# EAGLE design drv8353 based bldc (EAGLE 9.5.0)

## Sheet 1 of 3: Gate Driver & Signal Headers
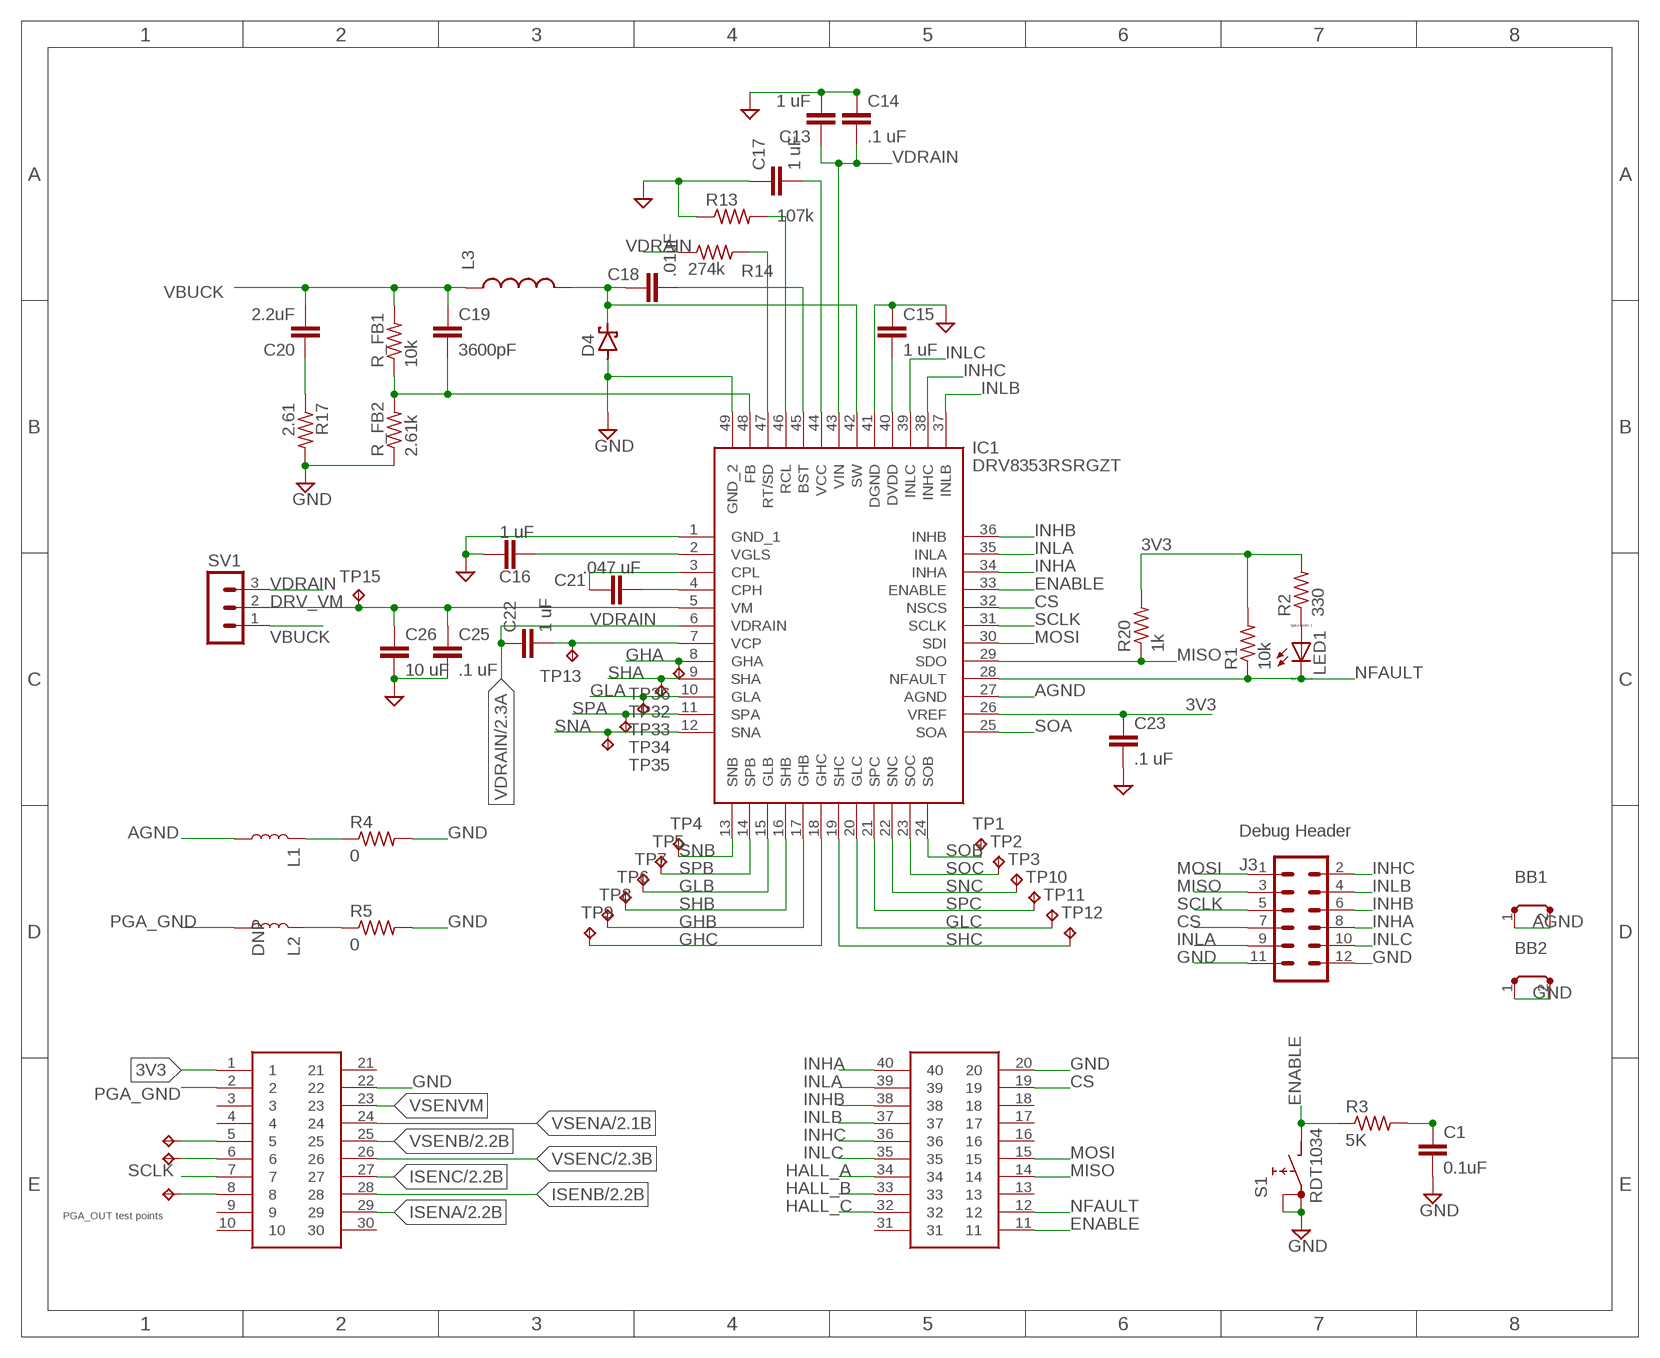
[diagram p0: schematic, sheet 1]

### Parts
BB1  TE3/2  [TE3/2]
BB2  TE3/2  [TE3/2]
C1  0.1uF  C-EUC0603K  [C0603K]
C13  1 uF  C-EUC1206K  [C1206K]
C14  .1 uF  C-EUC0805K  [C0805K]
C15  1 uF  C-EUC0603K  [C0603K]
C16  1 uF  C-EUC0603K  [C0603K]
C17  1 uF  C-EUC0603K  [C0603K]
C18  .01uF  C-EUC0603K  [C0603K]
C19  3600pF  C-EUC0603K  [C0603K]
C20  2.2uF  C-EUC0805K  [C0805K]
C21  .047 uF  C-EUC0805K  [C0805K]
C22  1 uF  C-EUC0603K  [C0603K]
C23  .1 uF  C-EUC0603K  [C0603K]
C25  .1 uF  C-EUC0805K  [C0805K]
C26  10 uF  C-EUC2220K  [C2220K]
D4  DFLS1200  [DFLS1200]
IC1  DRV8353RSRGZT  [QFN50P700X700X100-49N]
J3  2X6 FEMALE  CONN_06X2PTH_FEMALE  [2X6]
L1  33nH/±5%/500mA  INDUCTOR-0603-33NH  [0603]
L2  DNP  INDUCTOR-0603-33NH  [0603]
L3  330 uH  74404084331  [74404084331]
LED1  LED_ESML0603  [LED_SML0603]
R1  10k  R-US_R0603  [R0603]
R2  330  R-US_R0603  [R0603]
R3  5K  R-US_R0603  [R0603]
R4  0  R-US_R0603  [R0603]
R5  0  R-US_R0603  [R0603]
R13  107k  R-US_R0603  [R0603]
R14  274k  R-US_R0603  [R0603]
R17  2.61  R-US_R0603  [R0603]
R20  1k  R-US_R0603  [R0603]
R_FB1  10k  R-US_R0603  [R0603]
R_FB2  2.61k  R-US_R0603  [R0603]
S1  RDT1034  [RDT1034]
SV1  MA03-1  [MA03-1]
TP1  TPB1,27  [B1,27]
TP2  TPB1,27  [B1,27]
TP3  TPB1,27  [B1,27]
TP4  TPB1,27  [B1,27]
TP5  TPB1,27  [B1,27]
TP6  TPB1,27  [B1,27]
TP7  TPB1,27  [B1,27]
TP8  TPB1,27  [B1,27]
TP9  TPB1,27  [B1,27]
TP10  TPB1,27  [B1,27]
TP11  TPB1,27  [B1,27]
TP12  TPB1,27  [B1,27]
TP13  TPB1,27  [B1,27]
TP15  TPB1,27  [B1,27]
TP32  TPB1,27  [B1,27]
TP33  TPB1,27  [B1,27]
TP34  TPB1,27  [B1,27]
TP35  TPB1,27  [B1,27]
TP36  TPB1,27  [B1,27]
TP37  TPB1,27  [B1,27]
TP38  TPB1,27  [B1,27]
TP39  TPB1,27  [B1,27]
U$2  BOOSTER_DOCK  [BOOSTER_DOCK]

### Nets
3V3: C23.1 IC1.26(VREF) R1.2 R2.2 R20.2 U$2.1 ; also sheet 3
AGND: BB1.1(P) BB1.2(P) IC1.27(AGND) L1.1
BST: C18.2 IC1.45(BST)
CPH: C21.2 IC1.4(CPH)
CPL: C21.1 IC1.3(CPL)
CS: IC1.32(NSCS) J3.7 U$2.19
DRV_VM: C25.1 C26.1 IC1.5(VM) SV1.2 TP15.TP
ENABLE: IC1.33(ENABLE) R3.1 S1.B U$2.11
FB: C19.2 IC1.48(FB) R_FB1.1 R_FB2.2
GHA: IC1.8(GHA) TP36.TP ; also sheet 2
GHB: IC1.17(GHB) TP8.TP ; also sheet 2
GHC: IC1.18(GHC) TP9.TP ; also sheet 2
GLA: IC1.10(GLA) TP33.TP ; also sheet 2
GLB: IC1.15(GLB) TP7.TP ; also sheet 2
GLC: IC1.20(GLC) TP11.TP ; also sheet 2
GND: BB2.1(P) BB2.2(P) C1.2 C13.2 C14.1 C15.1 C16.1 C17.1 C23.2 C25.2 C26.2 D4.GND IC1.1(GND_1) IC1.41(DGND) IC1.49(GND_2) J3.11 J3.12 R4.2 R5.2 R13.1 R17.2 R_FB2.1 S1.A S1.A1 U$2.20 U$2.22 ; also sheet 2,3
HALL_A: U$2.34 ; also sheet 3
HALL_B: U$2.33 ; also sheet 3
HALL_C: U$2.32 ; also sheet 3
INHA: IC1.34(INHA) J3.8 U$2.40
INHB: IC1.36(INHB) J3.6 U$2.38
INHC: IC1.38(INHC) J3.2 U$2.36
INLA: IC1.35(INLA) J3.9 U$2.39
INLB: IC1.37(INLB) J3.4 U$2.37
INLC: IC1.39(INLC) J3.10 U$2.35
ISENA: U$2.29 ; also sheet 2
ISENB: U$2.28 ; also sheet 2
ISENC: U$2.27 ; also sheet 2
MISO: IC1.29(SDO) J3.3 R20.1 U$2.14
MOSI: IC1.30(SDI) J3.1 U$2.15
N$1: C15.2 IC1.40(DVDD)
N$14: C20.1 R17.1
N$16: LED1.A R2.1
N$17: TP39.TP U$2.8
N$18: TP38.TP U$2.6
N$19: TP37.TP U$2.5
N$20: C1.1 R3.2
N$21: L1.2 R4.1
N$23: L2.2 R5.1
NFAULT: IC1.28(NFAULT) LED1.C R1.1 U$2.12
PGA_GND: L2.1 U$2.2
RCL: IC1.46(RCL) R13.2
RT/SD: IC1.47(RT/SD) R14.2
SCLK: IC1.31(SCLK) J3.5 U$2.7
SHA: IC1.9(SHA) TP32.TP ; also sheet 2
SHB: IC1.16(SHB) TP6.TP ; also sheet 2
SHC: IC1.19(SHC) TP12.TP ; also sheet 2
SNA: IC1.12(SNA) TP35.TP ; also sheet 2
SNB: IC1.13(SNB) TP4.TP ; also sheet 2
SNC: IC1.22(SNC) TP3.TP ; also sheet 2
SOA: IC1.25(SOA) ; also sheet 2
SOB: IC1.24(SOB) TP1.TP ; also sheet 2
SOC: IC1.23(SOC) TP2.TP ; also sheet 2
SPA: IC1.11(SPA) TP34.TP ; also sheet 2
SPB: IC1.14(SPB) TP5.TP ; also sheet 2
SPC: IC1.21(SPC) TP10.TP ; also sheet 2
SW: C18.1 D4.LINE IC1.42(SW) L3.P$2
VBUCK: C19.1 C20.2 L3.P$1 R_FB1.2 SV1.1 ; also sheet 3
VCC: C17.2 IC1.44(VCC)
VCP: C22.2 IC1.7(VCP) TP13.TP
VDRAIN: C13.1 C14.2 C22.1 IC1.6(VDRAIN) IC1.43(VIN) R14.1 SV1.3 ; also sheet 2,3
VGLS: C16.2 IC1.2(VGLS)
VSENA: U$2.24 ; also sheet 2,3
VSENB: U$2.25 ; also sheet 2,3
VSENC: U$2.26 ; also sheet 2,3
VSENVM: U$2.23 ; also sheet 3
Unconnected: U$2.3 U$2.4 U$2.9 U$2.10 U$2.13 U$2.16 U$2.17 U$2.18 U$2.21 U$2.30 U$2.31

### Notes on the sheet
- Debug Header
- PGA_OUT test points

## Sheet 2 of 3: Half Bridges
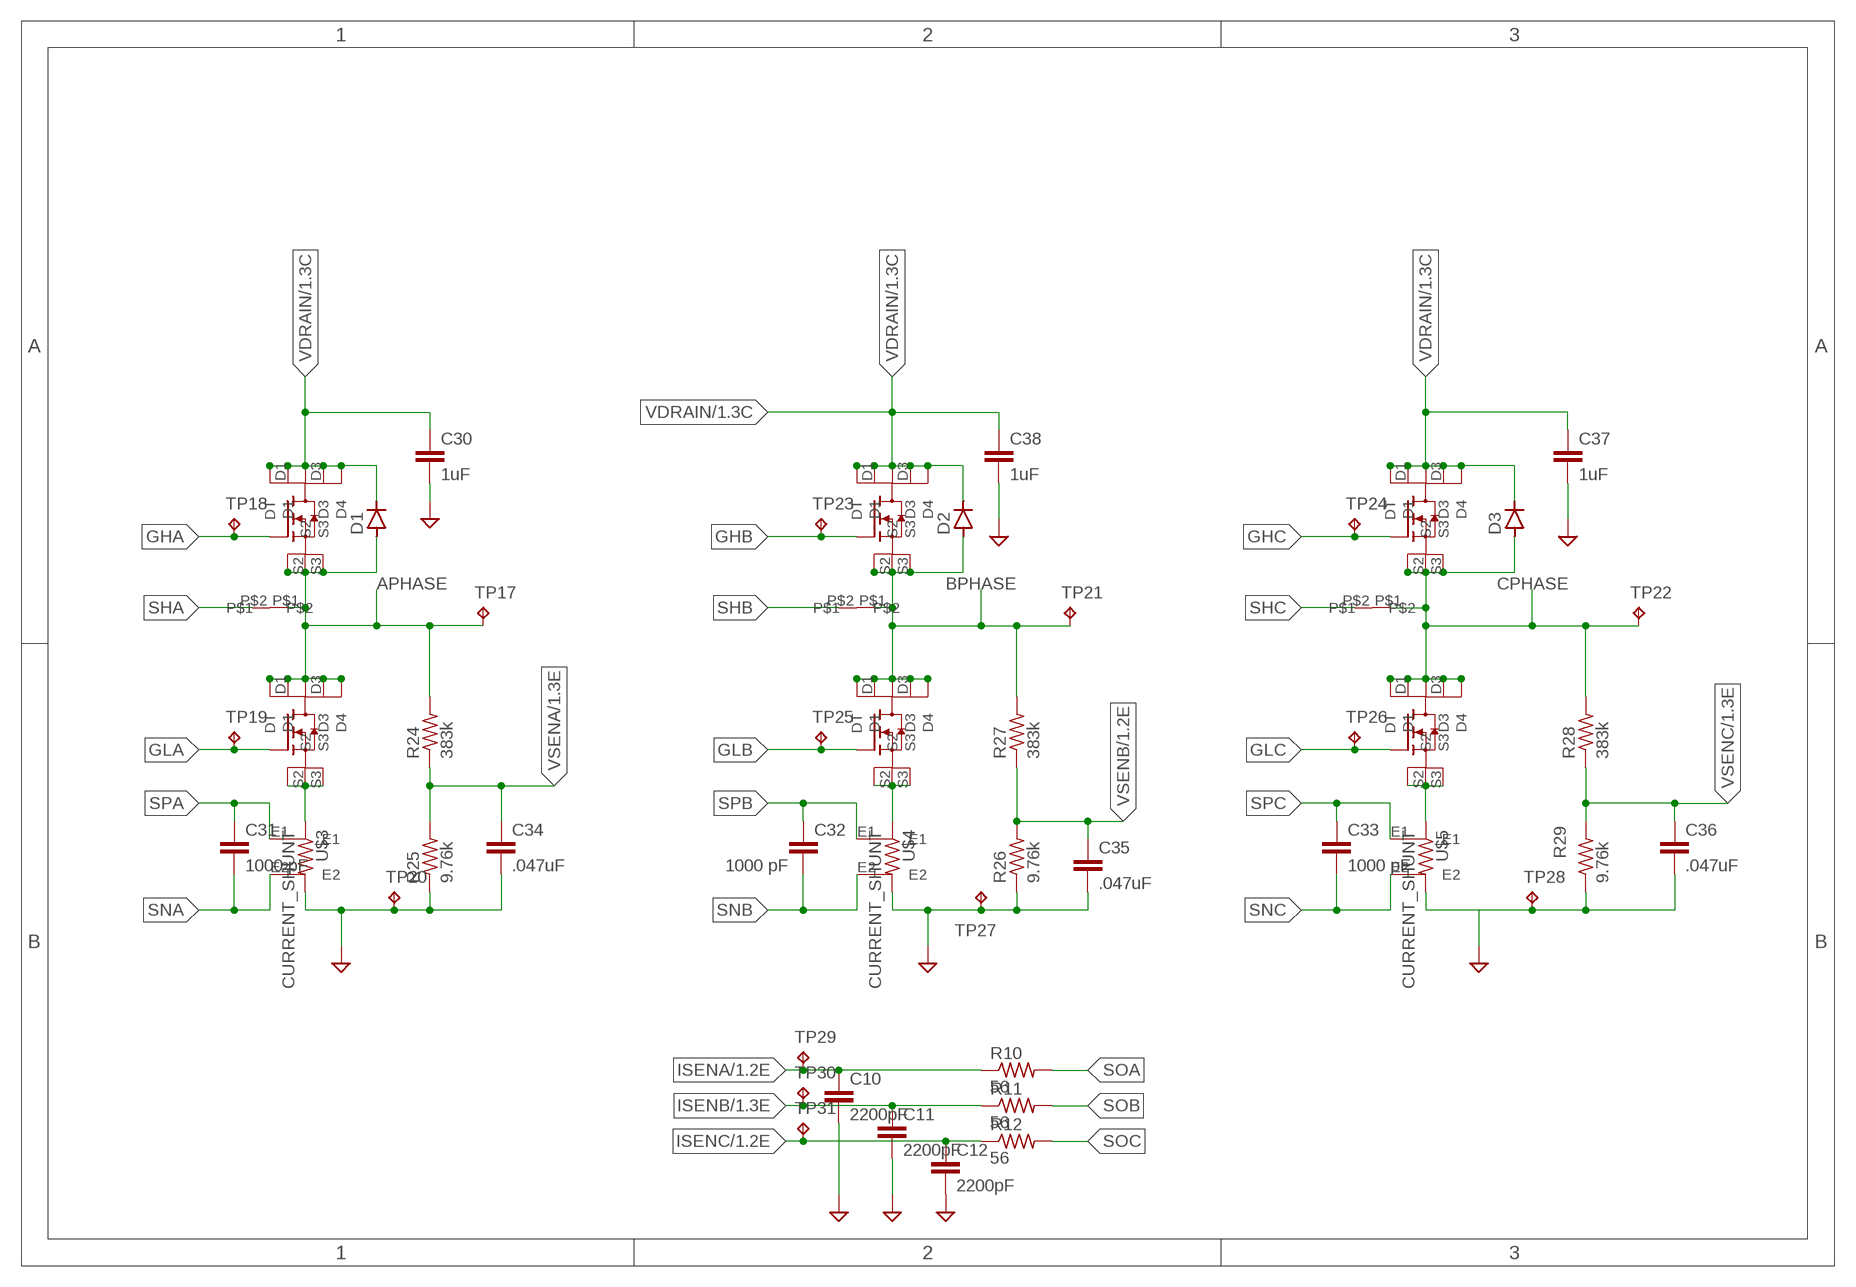
[diagram p1: schematic, sheet 2]

### Parts
C10  2200pF  C-EUC0603K  [C0603K]
C11  2200pF  C-EUC0603K  [C0603K]
C12  2200pF  C-EUC0603K  [C0603K]
C30  1uF  C-EUC1206  [C1206]
C31  1000 pF  C-EUC0603K  [C0603K]
C32  1000 pF  C-EUC0603K  [C0603K]
C33  1000 pF  C-EUC0603K  [C0603K]
C34  .047uF  C-EUC0603K  [C0603K]
C35  .047uF  C-EUC0603K  [C0603K]
C36  .047uF  C-EUC0603K  [C0603K]
C37  1uF  C-EUC0603K  [C0603K]
C38  1uF  C-EUC0603K  [C0603K]
D1  D-SOD123  [SOD123]
D2  D-SOD123  [SOD123]
D3  D-SOD123  [SOD123]
R10  56  R-US_R0603  [R0603]
R11  56  R-US_R0603  [R0603]
R12  56  R-US_R0603  [R0603]
R24  383k  R-US_R0603  [R0603]
R25  9.76k  R-US_R0603  [R0603]
R26  9.76k  R-US_R0603  [R0603]
R27  383k  R-US_R0603  [R0603]
R28  383k  R-US_R0603  [R0603]
R29  9.76k  R-US_R0603  [R0603]
TP17  TPB1,27  [B1,27]
TP18  TPB1,27  [B1,27]
TP19  TPB1,27  [B1,27]
TP20  TPB1,27  [B1,27]
TP21  TPB1,27  [B1,27]
TP22  TPB1,27  [B1,27]
TP23  TPB1,27  [B1,27]
TP24  TPB1,27  [B1,27]
TP25  TPB1,27  [B1,27]
TP26  TPB1,27  [B1,27]
TP27  TPB1,27  [B1,27]
TP28  TPB1,27  [B1,27]
TP29  TPB1,27  [B1,27]
TP30  TPB1,27  [B1,27]
TP31  TPB1,27  [B1,27]
U$3  CURRENT_SHUNT  [VISH_CSM3637_.002-2]
U$4  CURRENT_SHUNT  [VISH_CSM3637_.002-2]
U$5  CURRENT_SHUNT  [VISH_CSM3637_.002-2]
U$14  NVMTS1D2N08H  [PQFN88]
U$20  NVMTS1D2N08H  [PQFN88]
U$21  NVMTS1D2N08H  [PQFN88]
U$22  NVMTS1D2N08H  [PQFN88]
U$23  NVMTS1D2N08H  [PQFN88]
U$24  NVMTS1D2N08H  [PQFN88]
U$25  NET_TIE  [CNT]
U$27  NET_TIE  [CNT]
U$30  NET_TIE  [CNT]

### Nets
APHASE: D1.2(A) R24.2 TP17.TP U$14.S1 U$14.S2 U$14.S3 U$20.D1 U$20.D2 U$20.D3 U$20.D4 U$20.DT U$25.P$1 ; also sheet 3
BPHASE: D2.2(A) R27.2 TP21.TP U$21.D1 U$21.D2 U$21.D3 U$21.D4 U$21.DT U$22.S1 U$22.S2 U$22.S3 U$27.P$1 ; also sheet 3
CPHASE: D3.2(A) R28.2 TP22.TP U$23.S1 U$23.S2 U$23.S3 U$24.D1 U$24.D2 U$24.D3 U$24.D4 U$24.DT U$30.P$1 ; also sheet 3
GHA: TP18.TP U$14.G ; also sheet 1
GHB: TP23.TP U$22.G ; also sheet 1
GHC: TP24.TP U$23.G ; also sheet 1
GLA: TP19.TP U$20.G ; also sheet 1
GLB: TP25.TP U$21.G ; also sheet 1
GLC: TP26.TP U$24.G ; also sheet 1
GND: C10.2 C11.2 C12.2 C30.2 C34.2 C35.2 C36.2 C37.2 C38.2 R25.1 R26.1 R29.1 TP20.TP TP27.TP TP28.TP U$3.I2 U$4.I2 U$5.I2 ; also sheet 1,3
ISENA: C10.1 R10.1 TP29.TP ; also sheet 1
ISENB: C11.1 R11.1 TP30.TP ; also sheet 1
ISENC: C12.1 R12.1 TP31.TP ; also sheet 1
N$22: U$4.I1 U$21.S1 U$21.S2 U$21.S3
N$24: U$3.I1 U$20.S1 U$20.S2 U$20.S3
N$27: U$5.I1 U$24.S1 U$24.S2 U$24.S3
SHA: U$25.P$2 ; also sheet 1
SHB: U$27.P$2 ; also sheet 1
SHC: U$30.P$2 ; also sheet 1
SNA: C31.2 U$3.E2 ; also sheet 1
SNB: C32.2 U$4.E2 ; also sheet 1
SNC: C33.2 U$5.E2 ; also sheet 1
SOA: R10.2 ; also sheet 1
SOB: R11.2 ; also sheet 1
SOC: R12.2 ; also sheet 1
SPA: C31.1 U$3.E1 ; also sheet 1
SPB: C32.1 U$4.E1 ; also sheet 1
SPC: C33.1 U$5.E1 ; also sheet 1
VDRAIN: C30.1 C37.1 C38.1 D1.1(C) D2.1(C) D3.1(C) U$14.D1 U$14.D2 U$14.D3 U$14.D4 U$14.DT U$22.D1 U$22.D2 U$22.D3 U$22.D4 U$22.DT U$23.D1 U$23.D2 U$23.D3 U$23.D4 U$23.DT ; also sheet 1,3
VSENA: C34.1 R24.1 R25.2 ; also sheet 1,3
VSENB: C35.1 R26.2 R27.1 ; also sheet 1,3
VSENC: C36.1 R28.1 R29.2 ; also sheet 1,3

## Sheet 3 of 3: Power Connections / Converters
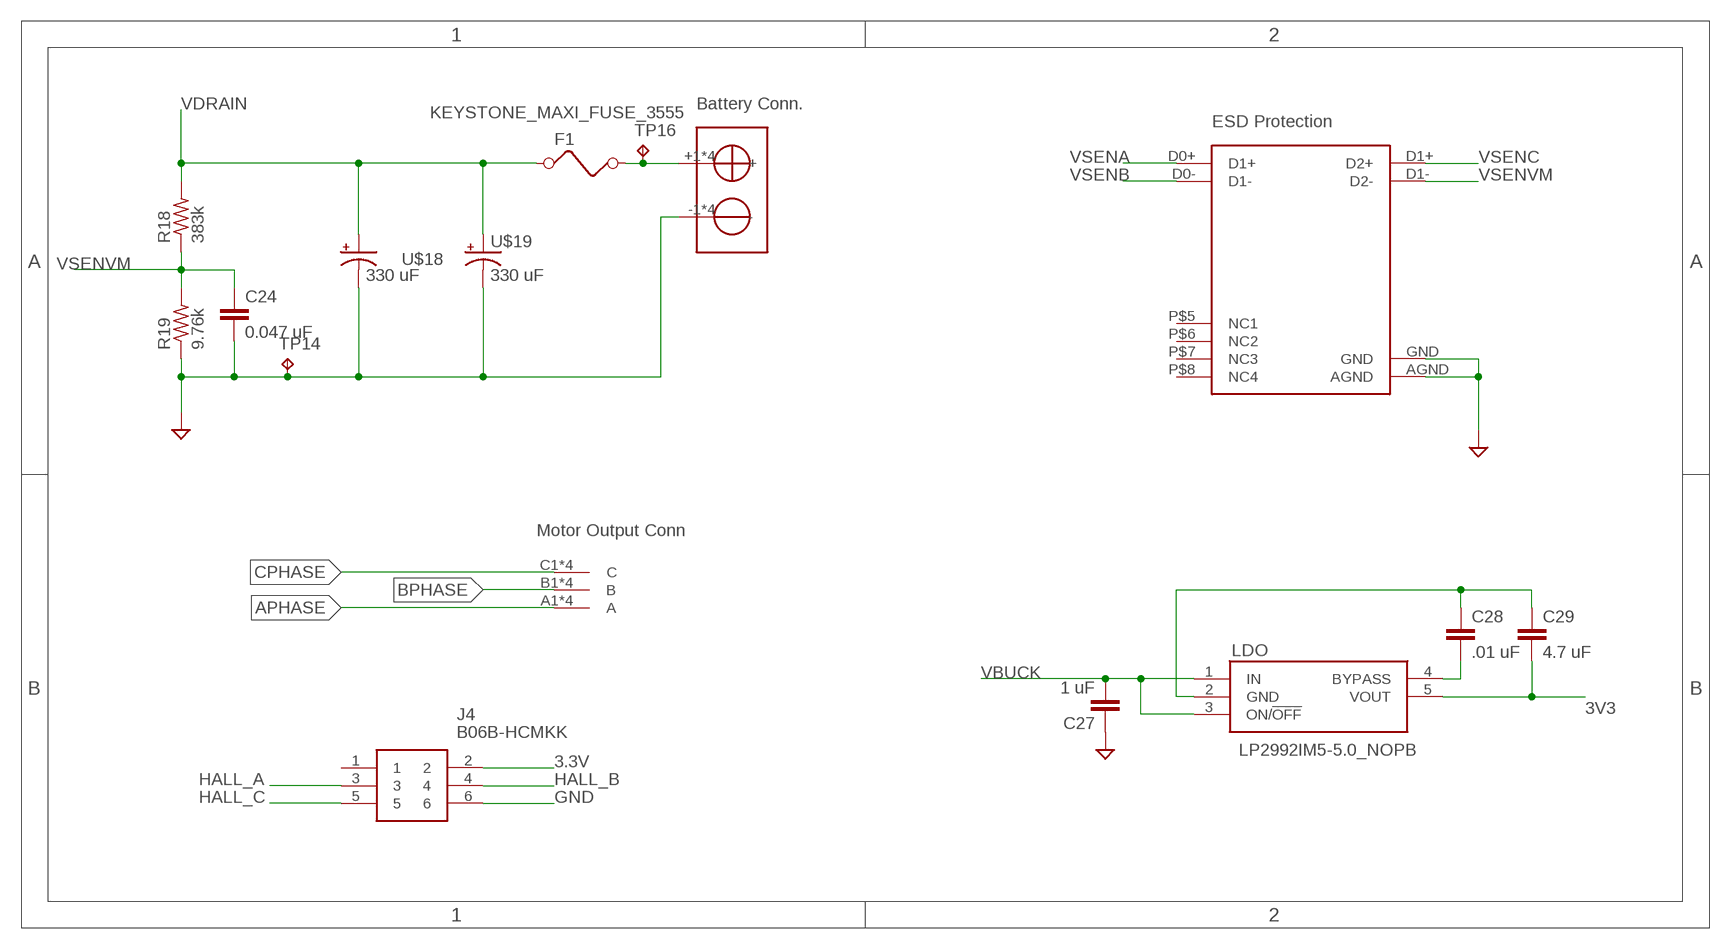
[diagram p2: schematic, sheet 3]

### Parts
C24  0.047 uF  C-EUC0603K  [C0603K]
C27  1 uF  C-EUC0805K  [C0805K]
C28  .01 uF  C-EUC0603K  [C0603K]
C29  4.7 uF  C-EUC1210K  [C1210K]
F1  KEYSTONE_MAXI_FUSE_3555  [KEYSTONE_MAXI_FUSE_CLIP_3555]
J4  B06B-HCMKK  [B06BHCMKK]
LDO  LP2992IM5-5.0_NOPB  [SOT95P280X145-5N]
R18  383k  R-US_R0603  [R0603]
R19  9.76k  R-US_R0603  [R0603]
TP14  TPB1,27  [B1,27]
TP16  TPB1,27  [B1,27]
TVS_DIODE  TPD4S010DQAR  [TPD4S010DQAR]
U$1  TRIPPLE-MINI-PP75  [TRIPPLE-MINI-PP75]
U$16  SB50  [MINI-SB-50]
U$18  330 uF  RADIALK16  [SM_RADIAL_K16_1PRIMARY]
U$19  330 uF  RADIALK16  [SM_RADIAL_K16_1PRIMARY]

### Nets
3.3V: J4.2
3V3: C29.2 LDO.5(VOUT) ; also sheet 1
APHASE: U$1.A1(A) U$1.A2(A) U$1.A3(A) U$1.A4(A) ; also sheet 2
BPHASE: U$1.B1(B) U$1.B2(B) U$1.B3(B) U$1.B4(B) ; also sheet 2
CPHASE: U$1.C1(C) U$1.C2(C) U$1.C3(C) U$1.C4(C) ; also sheet 2
GND: C24.2 C27.1 J4.6 R19.1 TP14.TP TVS_DIODE.AGND TVS_DIODE.GND U$16.-1(-) U$16.-2(-) U$16.-3(-) U$16.-4(-) U$18.- U$19.- ; also sheet 1,2
HALL_A: J4.3 ; also sheet 1
HALL_B: J4.4 ; also sheet 1
HALL_C: J4.5 ; also sheet 1
N$5: C28.1 C29.1 LDO.2(GND)
N$13: C28.2 LDO.4(BYPASS)
N$15: F1.B1 F1.B2 TP16.TP U$16.+1(+) U$16.+2(+) U$16.+3(+) U$16.+4(+)
VBUCK: C27.2 LDO.1(IN) LDO.3(ON/!OFF) ; also sheet 1
VDRAIN: F1.A1 F1.A2 R18.2 U$18.+ U$19.+ ; also sheet 1,2
VSENA: TVS_DIODE.D0+(D1+) ; also sheet 1,2
VSENB: TVS_DIODE.D0-(D1-) ; also sheet 1,2
VSENC: TVS_DIODE.D1+(D2+) ; also sheet 1,2
VSENVM: C24.1 R18.1 R19.2 TVS_DIODE.D1-(D2-) ; also sheet 1
Unconnected: J4.1 TVS_DIODE.P$5(NC1) TVS_DIODE.P$6(NC2) TVS_DIODE.P$7(NC3) TVS_DIODE.P$8(NC4)

### Notes on the sheet
- Battery Conn.
- ESD Protection
- Motor Output Conn

## Library data of the parts
BB1 BB2 = busbar:TE3/2: BUS BAR 2 connections, grid 3 TE
C1 C14 C22 C23 = resistor:C-EU: CAPACITOR, European symbol
C10-C13 C15-C21 C24-C38 = rcl:C-EU: CAPACITOR, European symbol; SPICEPREFIX: C
D1-D3 = semicon-smd-ipc:D-: DIODE unfilled
D4 = REV BLDC:DFLS1200; SPICEPREFIX: B
F1 = REV BLDC:KEYSTONE_MAXI_FUSE_3555
IC1 = REV BLDC:DRV8353RSRGZT: 100-V Three-Phase Smart Gate Driver With Buck Regulator and Three Current Shunt Amplifiers Source: Datasheet <http://www.ti.com/lit/gpn/drv8353r>; DESCRIPTION: 100-V Three-Phase Smart Gate Driver With Buck Regulator and Three Current Shunt Amplifiers; HEIGHT: 1mm; MANUFACTURER_NAME: Texas Instruments; MANUFACTURER_PART_NUMBER: DRV8353RSRGZT; MOUSER_PART_NUMBER: 595-DRV8353RSRGZT; MOUSER_PRICE-STOCK: https://www.mouser.com/Search/Refine.aspx?Keyword=595-DRV8353RSRGZT
J3 = SparkFun-Connectors:CONN_06X2: Multi connection point. Often used as Generic Header-pin footprint for 0.1 inch spaced/style header connections On any of the 0.1 inch spaced packages, you can populate with these: Break Away Headers - Straight <https://www.sparkfun.com/products/116> (PRT-00116) Break Away Male Headers - Right Angle <https://www.sparkfun.com/products/553> (PRT-00553) Female Headers <https://www.sparkfun.com/products/115> (PRT-00115) Break Away Headers - Machine Pin <https://www.sparkfun.com/products/117> (PRT-00117) Break Away Female Headers - Swiss Machine Pin <https://www.sparkfun.com/products/743> (PRT-00743); PROD_ID: CONN-12423
J4 = SamacSys_Parts:B06B-HCMKK: Automotive Connectors 6P AIT Header Top Position (BLK) Source: Datasheet <https://componentsearchengine.com/Datasheets/1/B06B-HCMKK.pdf>; DESCRIPTION: Automotive Connectors 6P AIT Header Top Position (BLK); HEIGHT: 13.7mm; MANUFACTURER_NAME: JST (JAPAN SOLDERLESS TERMINALS); MANUFACTURER_PART_NUMBER: B06B-HCMKK; MOUSER_PART_NUMBER: 306-B06B-HCMKK; MOUSER_PRICE-STOCK: https://www.mouser.com/Search/Refine.aspx?Keyword=306-B06B-HCMKK
L1 = SparkFun-Coils:INDUCTOR: Inductors Resist changes in electrical current. Basically a coil of wire. SparkFun Products: SparkFun Load Cell Amplifier - HX711 <https://www.sparkfun.com/products/13879> IOIO-OTG - V2.2 <https://www.sparkfun.com/products/13613>; PROD_ID: NDUC-07874
L2 = SparkFun-Coils:INDUCTOR: Inductors Resist changes in electrical current. Basically a coil of wire. SparkFun Products: SparkFun Load Cell Amplifier - HX711 <https://www.sparkfun.com/products/13879> IOIO-OTG - V2.2 <https://www.sparkfun.com/products/13613>; PROD_ID: NDUC-07874; VALUE: 33nH/±5%/500mA
L3 = REV BLDC:74404084331
LDO = SamacSys_Parts:LP2992IM5-5.0_NOPB: Micropower 250 mA Low-Noise Ultra Low-Dropout Regulator Source: Datasheet <http://www.ti.com/lit/ds/symlink/lp2992.pdf>; DESCRIPTION: Micropower 250 mA Low-Noise Ultra Low-Dropout Regulator; HEIGHT: 1.45mm; MANUFACTURER_NAME: Texas Instruments; MANUFACTURER_PART_NUMBER: LP2992IM5-5.0/NOPB; MOUSER_PART_NUMBER: 926-2992IM5-5.0/NOPB; MOUSER_PRICE-STOCK: https://www.mouser.com/Search/Refine.aspx?Keyword=926-2992IM5-5.0%2FNOPB
LED1 = eagle-ltspice:LED_E: LED Source: http://www.osram.convergy.de Source: www.luxeon.com Source: www.kingbright.com; SPICEMODEL: NONE; SPICEPREFIX: D; SPICETYPE: diode
R1 R2 R10-R14 R17-R20 R24-R29 R_FB1 R_FB2 = rcl:R-US_: RESISTOR, American symbol; SPICEPREFIX: R
R3-R5 = resistor:R-US_: RESISTOR, American symbol
S1 = switch:RDT1034: PUSH SWITCH www.radiohm.com
SV1 = con-lstb:MA03-1: PIN HEADER; OC_FARNELL: unknown; OC_NEWARK: unknown
TP1-TP39 = testpad:TP: Test pad
TVS_DIODE = REV BLDC:TPD4S010DQAR
U$1 = REV BLDC:TRIPPLE-MINI-PP75
U$2 = REV BLDC:BOOSTER_DOCK
U$3-U$5 = REV BLDC:CURRENT_SHUNT
U$14 U$20-U$24 = REV BLDC:NVMTS1D2N08H
U$16 = REV BLDC:SB50
U$18 U$19 = REV BLDC:RADIALK16
U$25 U$27 U$30 = REV BLDC:NET_TIE

## Board
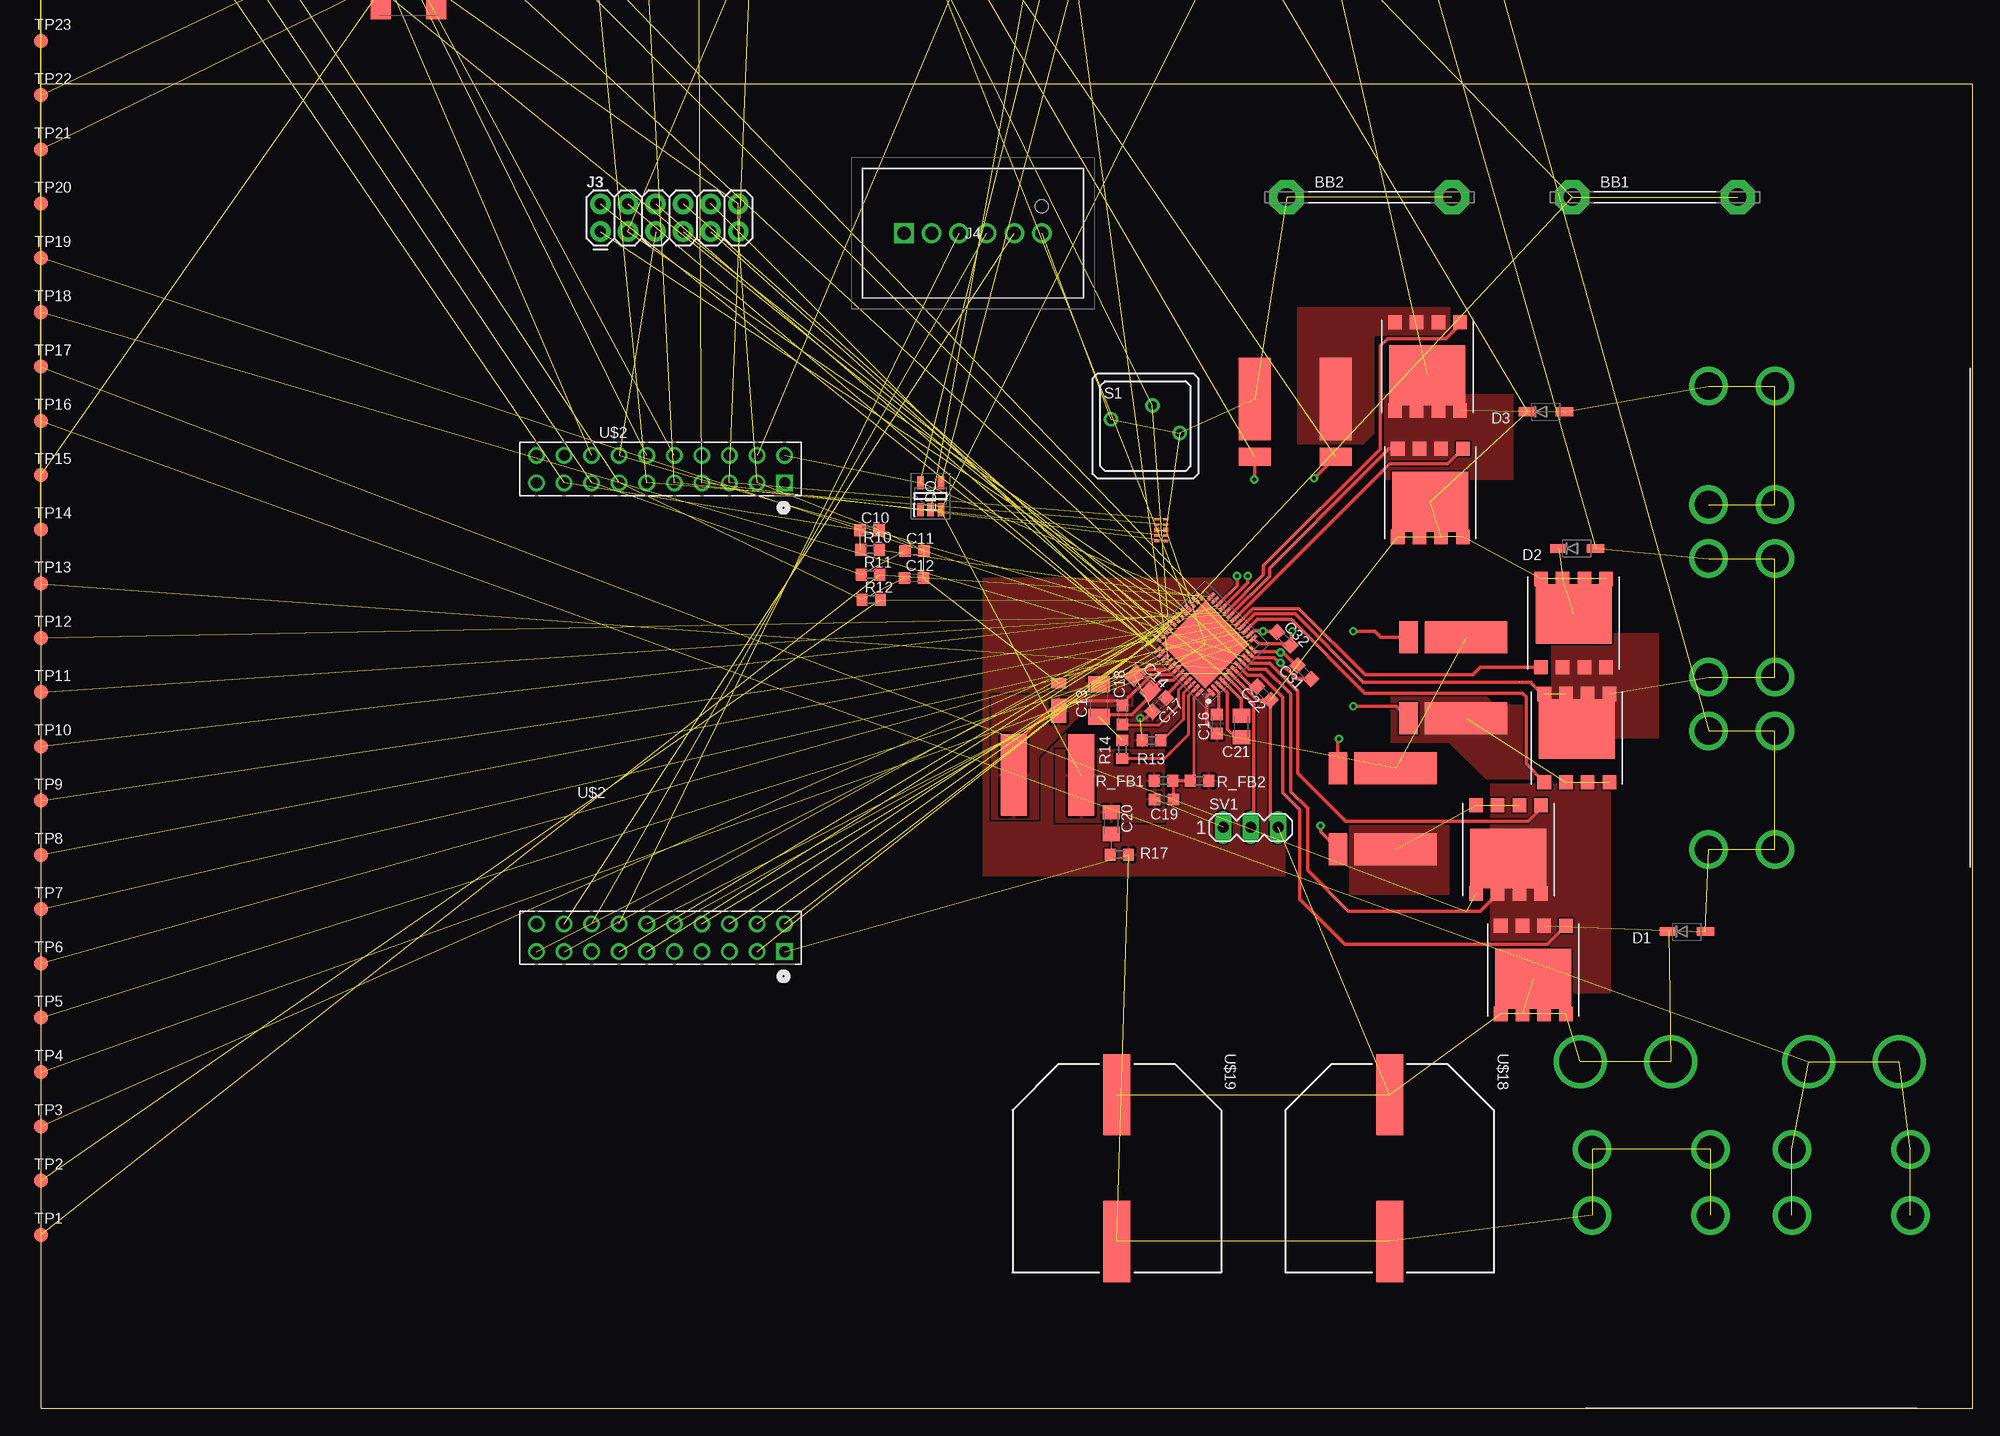
[diagram p3: board, top side]
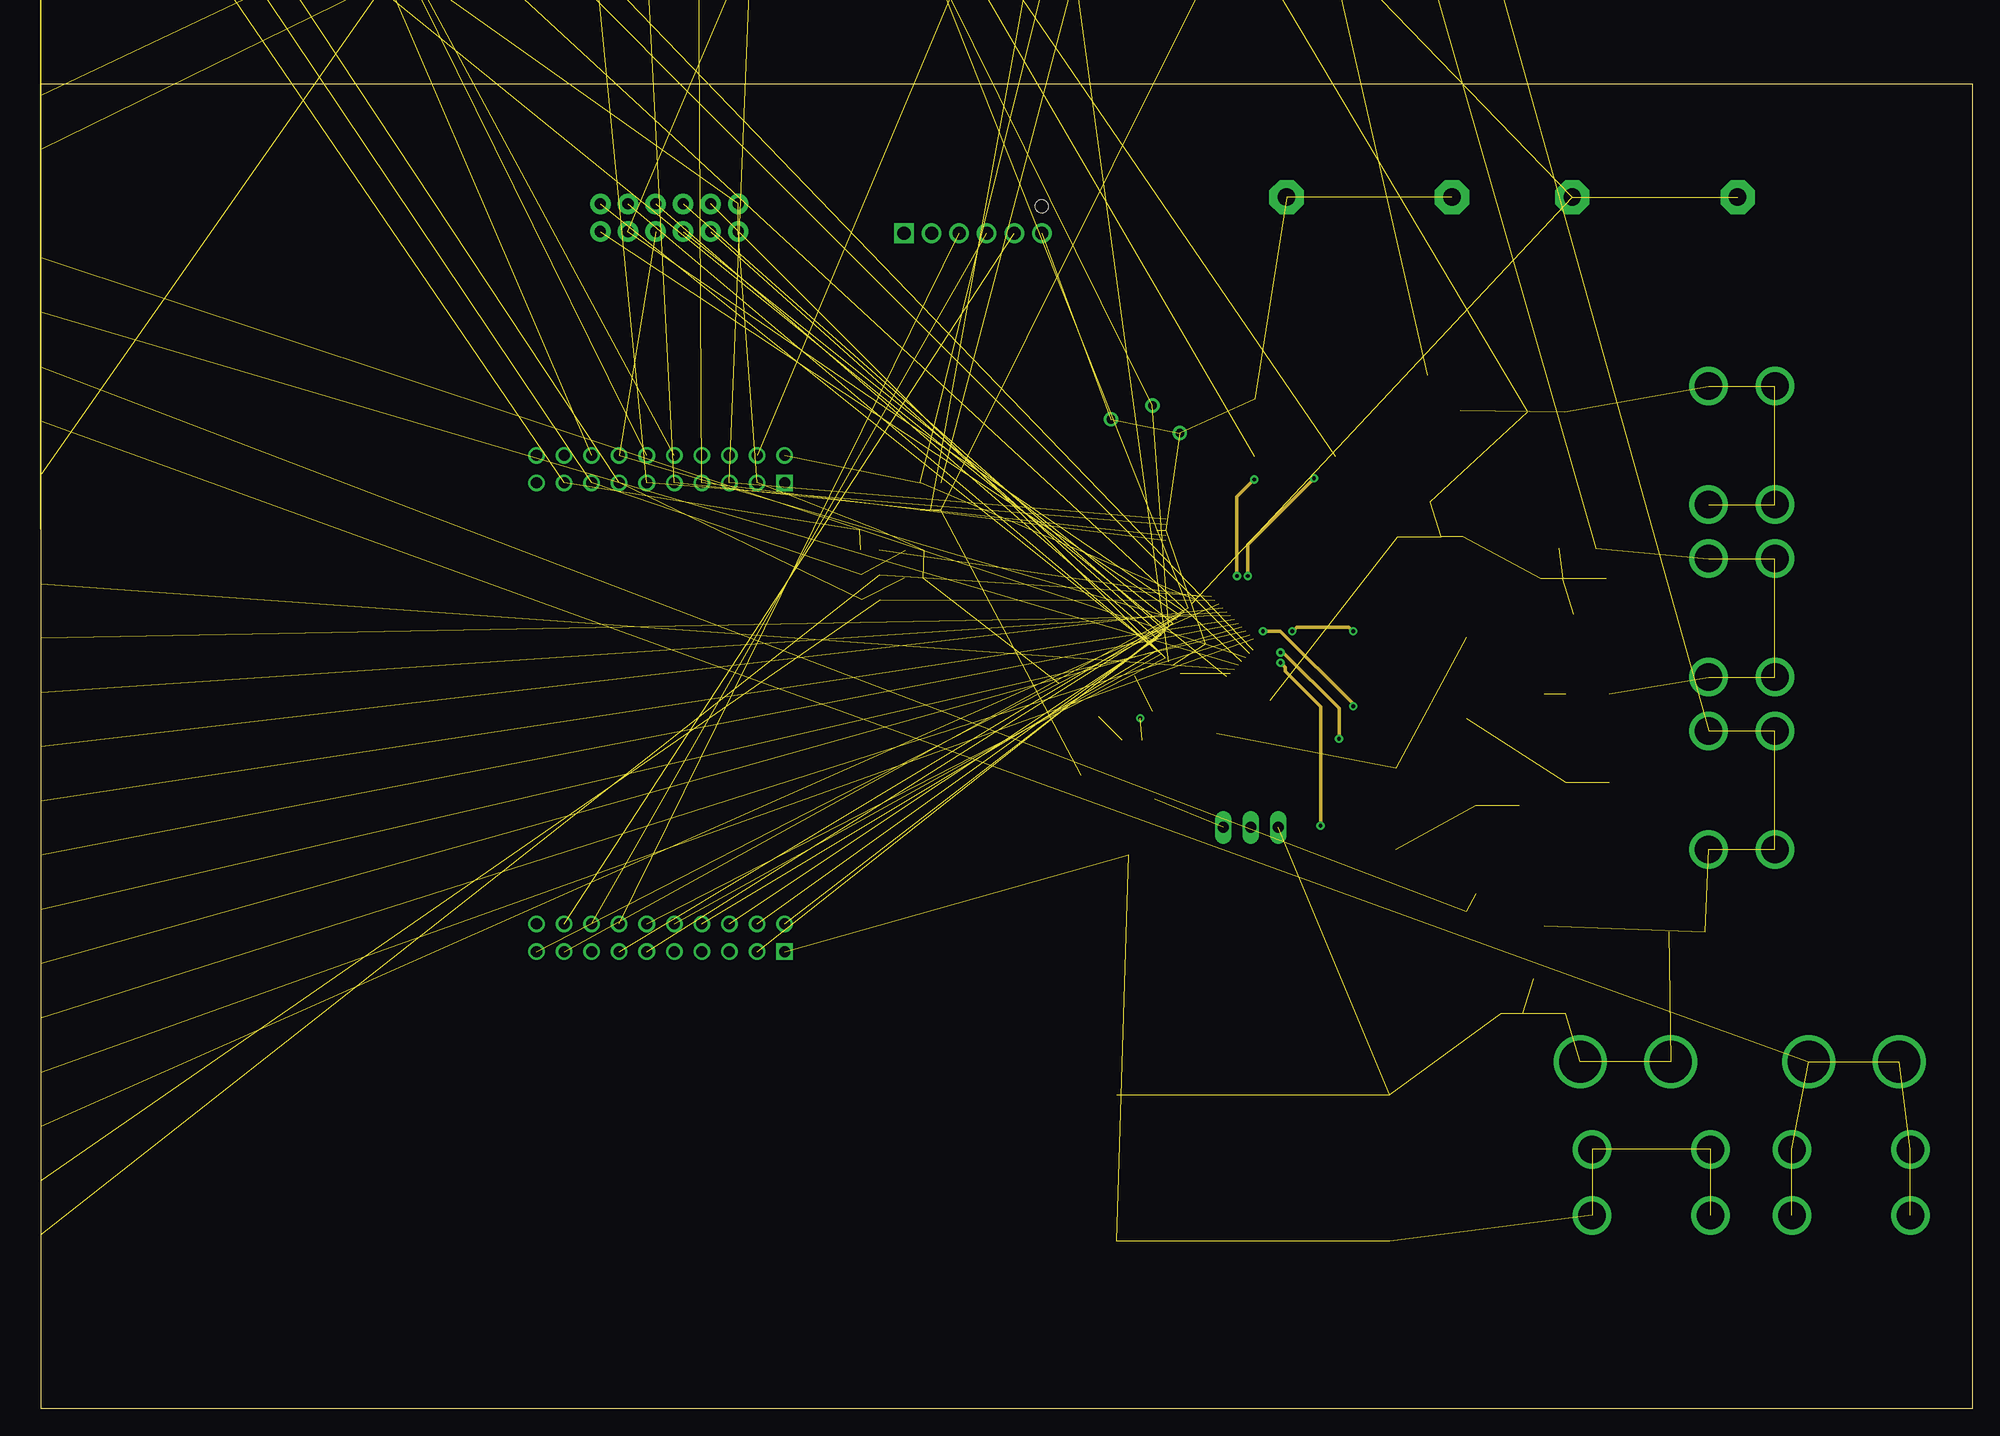
[diagram p4: board, inner layer Route15]
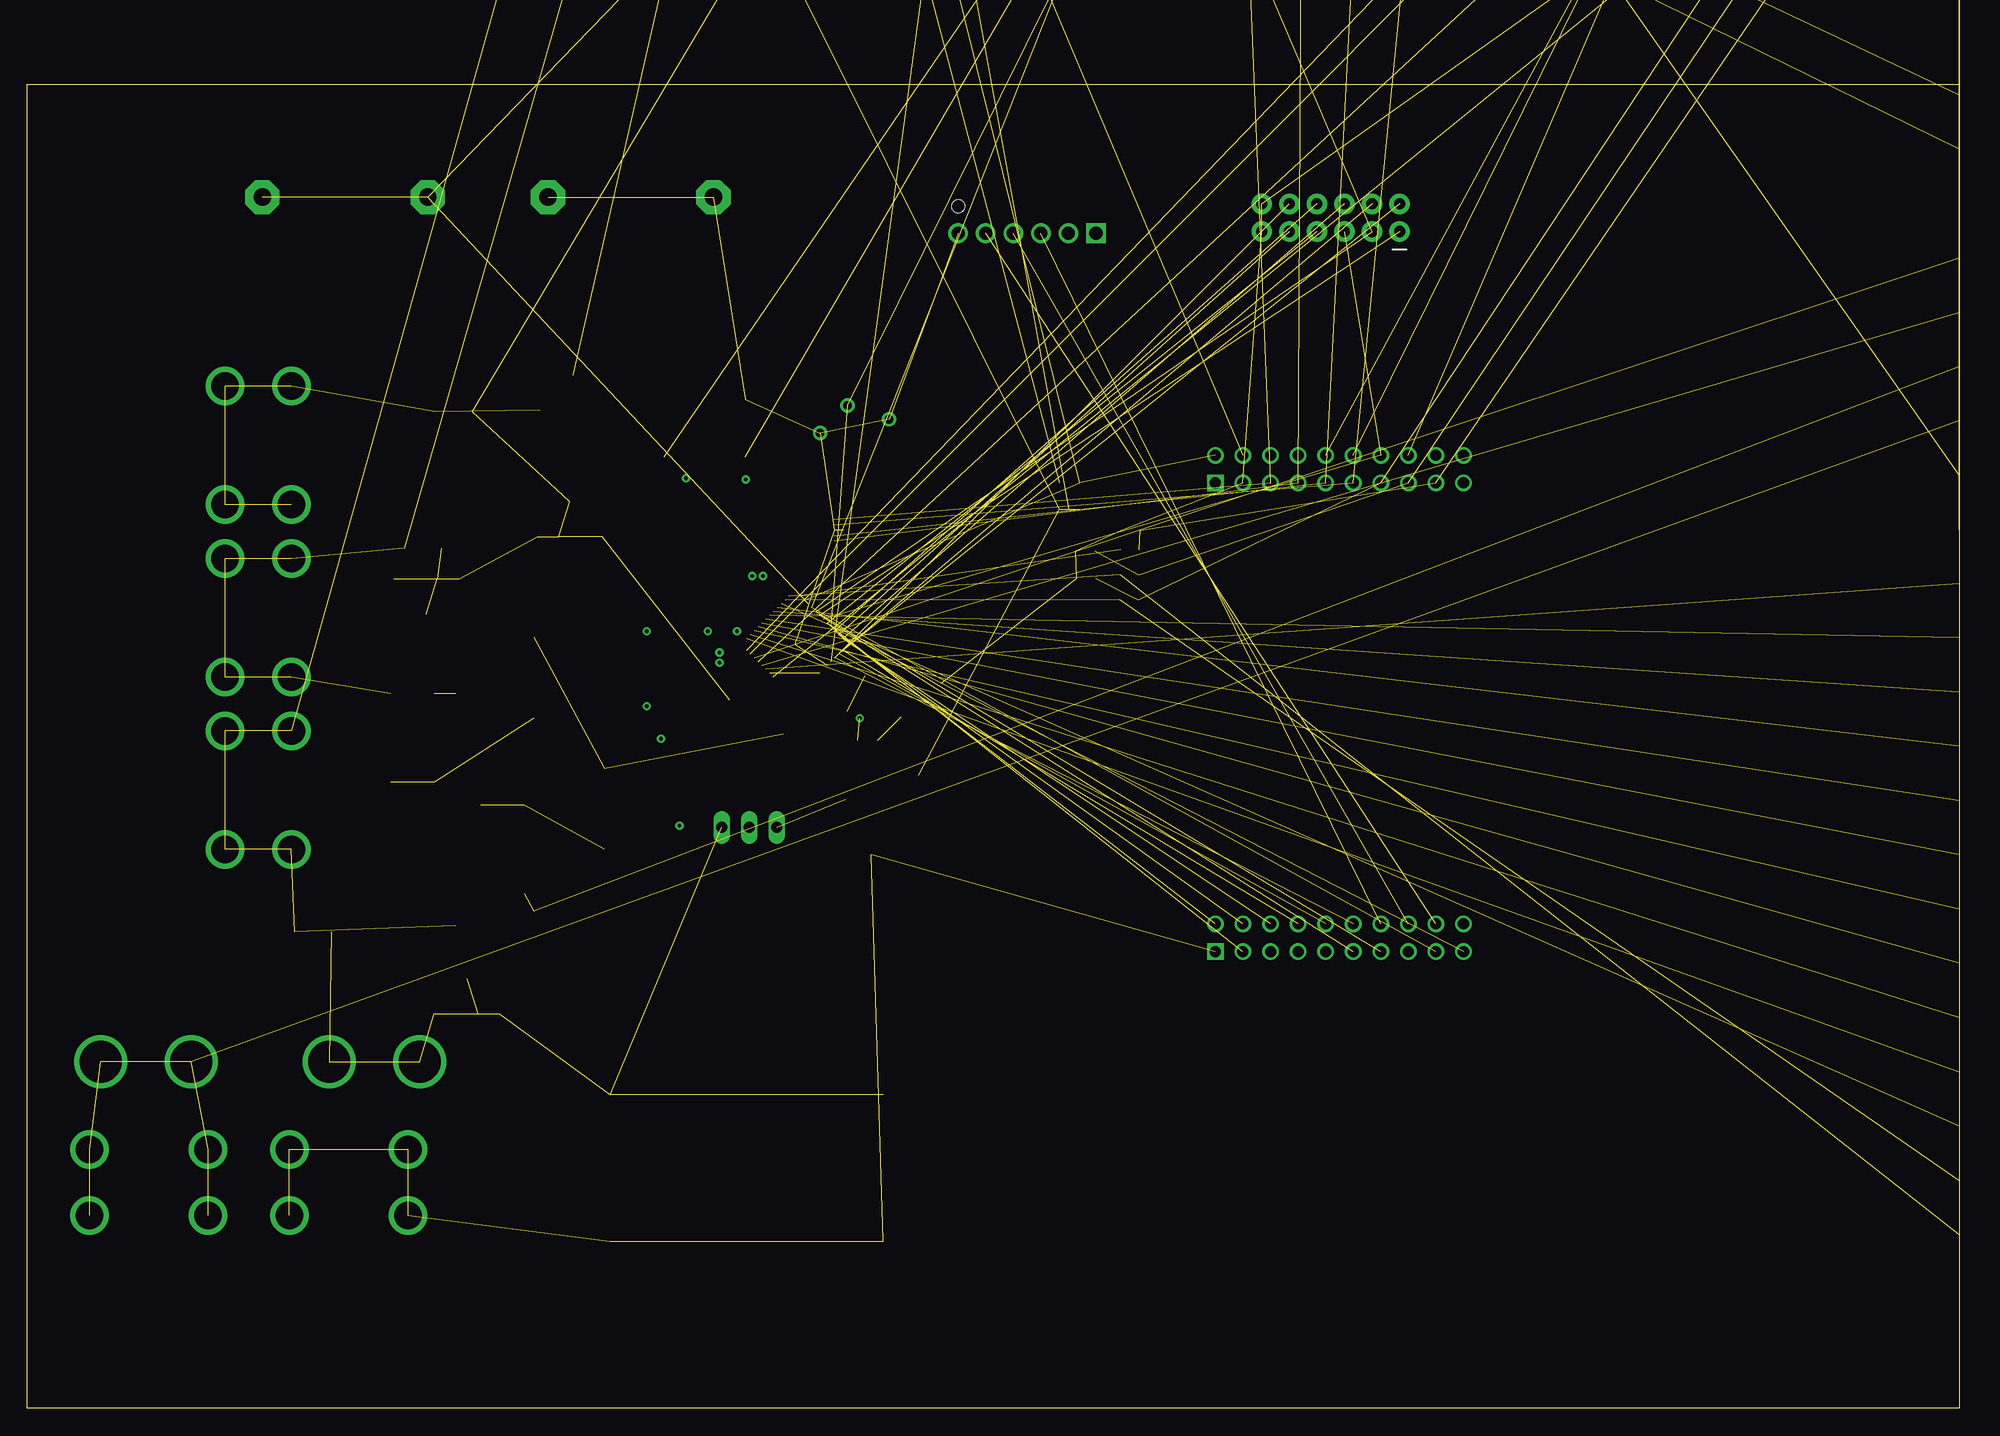
[diagram p5: board, bottom side, seen from below]

Size 178 x 122 mm. Coordinates in mm from the lower left corner, seen from the top.
Outline: 0,0 178,0 178,122 0,122 0,0
Copper layers (1+2*15+16): Top 0.035mm / dielectric 0.15mm / Route2 0.035mm / dielectric 0.5mm / Route15 0.035mm / dielectric 0.15mm / Bottom 0.035mm
Design rules "default *": minimum track width 6mil, minimum drill 10mil, track to track 6mil, track to pad 6mil, pad to pad 6mil, via to via 6mil, smd to smd 6mil, copper to edge 15mil, drill to drill 6mil, minimum pad ring 10mil, minimum via ring 8mil, stop-mask expansion 4mil, vias tented up to drill 0mil, thermal gap 10mil

### Footprints (pad centres in the part's own frame; a part is rotated, then mirrored left to right if it is on the bottom)
TE3/2 = drill 1.6 pad 3.15 octagon: 1 -7.62,0; 2 7.62,0
C0603K = smd 1.05 x 1.08: 1 -0.875,0; 2 0.875,0
C1206K = smd 1.5 x 2: 1 -1.5,0; 2 1.5,0
C0805K = smd 1.3 x 1.6: 1 -1,0; 2 1,0
C2220K = smd 1.85 x 5.5: 1 -2.55,0; 2 2.55,0
C1210K = smd 1.5 x 2.9: 1 -1.5,0; 2 1.5,0
C1206 = smd 1.6 x 1.8: 1 -1.4,0; 2 1.4,0
SOD123 = smd 1.6 x 0.8: 1 -1.7,0; 2 1.7,0
DFLS1200 = smd 0.9 x 1.4: GND 1.45,0 | smd 2.2 x 1.4: LINE -1.1,0
KEYSTONE_MAXI_FUSE_CLIP_3555 = drill 3.861: A1 -14.681,0; A2 -6.35,0; B1 6.35,0; B2 14.681,0
QFN50P700X700X100-49N = smd 0.85 x 0.3: 1 -3.5,2.75; 2 -3.5,2.25; 3 -3.5,1.75; 4 -3.5,1.25; 5 -3.5,0.75; 6 -3.5,0.25; 7 -3.5,-0.25; 8 -3.5,-0.75; 9 -3.5,-1.25; 10 -3.5,-1.75; 11 -3.5,-2.25; 12 -3.5,-2.75; 25 3.5,-2.75; 26 3.5,-2.25; 27 3.5,-1.75; 28 3.5,-1.25; 29 3.5,-0.75; 30 3.5,-0.25; 31 3.5,0.25; 32 3.5,0.75; 33 3.5,1.25; 34 3.5,1.75; 35 3.5,2.25; 36 3.5,2.75 | smd 0.3 x 0.85: 13 -2.75,-3.5; 14 -2.25,-3.5; 15 -1.75,-3.5; 16 -1.25,-3.5; 17 -0.75,-3.5; 18 -0.25,-3.5; 19 0.25,-3.5; 20 0.75,-3.5; 21 1.25,-3.5; 22 1.75,-3.5; 23 2.25,-3.5; 24 2.75,-3.5; 37 2.75,3.5; 38 2.25,3.5; 39 1.75,3.5; 40 1.25,3.5; 41 0.75,3.5; 42 0.25,3.5; 43 -0.25,3.5; 44 -0.75,3.5; 45 -1.25,3.5; 46 -1.75,3.5; 47 -2.25,3.5; 48 -2.75,3.5 | smd 5.7 x 5.7: 49 0,0
2X6 = drill 1.016 pad 1.88: 1 0,0; 2 0,2.54; 3 2.54,0; 4 2.54,2.54; 5 5.08,0; 6 5.08,2.54; 7 7.62,0; 8 7.62,2.54; 9 10.16,0; 10 10.16,2.54; 11 12.7,0; 12 12.7,2.54
B06BHCMKK = drill 1.2 pad 1.8 square: 1 0,0 | drill 1.2 pad 1.8: 2 2.54,0; 3 5.08,0; 4 7.62,0; 5 10.16,0; 6 12.7,0 | hole 1.2: 12.7,2.5
0603 = smd 1.1 x 1: 1 -0.85,0; 2 0.85,0
74404084331 = smd 2.4 x 7.5: P$1 -3.1,0; P$2 3.1,0
SOT95P280X145-5N = smd 1.2 x 0.6: 1 -1.25,0.95; 2 -1.25,0; 3 -1.25,-0.95; 4 1.25,-0.95; 5 1.25,0.95
LED_SML0603 = smd 0.8 x 0.8: A 0.75,0; C -0.75,0
R0603 = smd 1 x 1.1: 1 -0.85,0; 2 0.85,0
RDT1034 = drill 0.8: A 3.175,-0.635; A1 -3.175,0.635; B 0.65,1.9
MA03-1 = drill 1.016 long: 1 -2.54,0; 2 0,0; 3 2.54,0
B1,27 = smd 1.27 x 1.27: TP 0,0
TPD4S010DQAR = smd 0.565 x 0.4: AGND -0.417,0; GND 0.417,0 | smd 0.565 x 0.2: D0+ 0.417,-1; D0- 0.417,-0.5; D1+ 0.417,0.5; D1- 0.417,1; P$5 -0.417,1; P$6 -0.417,0.5; P$7 -0.417,-0.5; P$8 -0.417,-1
TRIPPLE-MINI-PP75 = drill 2.53: A1 -6.1,-21.34; A2 0,-21.34; A3 -6.1,-10.42; A4 0,-10.42; B1 -6.1,-5.46; B2 0,-5.46; B3 -6.1,5.46; B4 0,5.46; C1 -6.1,10.42; C2 0,10.42; C3 -6.1,21.34; C4 0,21.34
BOOSTER_DOCK = drill 1.016 pad 1.524: 1 -22.86,11.43; 2 -22.86,8.89; 3 -22.86,6.35; 4 -22.86,3.81; 5 -22.86,1.27; 6 -22.86,-1.27; 7 -22.86,-3.81; 8 -22.86,-6.35; 9 -22.86,-8.89; 10 -22.86,-11.43; 11 22.86,-11.43; 12 22.86,-8.89; 13 22.86,-6.35; 14 22.86,-3.81; 15 22.86,-1.27; 16 22.86,1.27; 17 22.86,3.81; 18 22.86,6.35; 19 22.86,8.89; 22 -20.32,8.89; 23 -20.32,6.35; 24 -20.32,3.81; 25 -20.32,1.27; 26 -20.32,-1.27; 27 -20.32,-3.81; 28 -20.32,-6.35; 29 -20.32,-8.89; 30 -20.32,-11.43; 31 20.32,-11.43; 32 20.32,-8.89; 33 20.32,-6.35; 34 20.32,-3.81; 35 20.32,-1.27; 36 20.32,1.27; 37 20.32,3.81; 38 20.32,6.35; 39 20.32,8.89; 40 20.32,11.43 | drill 1.016 pad 1.524 square: 20 22.86,11.43; 21 -20.32,11.43
VISH_CSM3637_.002-2 = smd 2.95 x 1.68: E1 -3.735,4.155; E2 3.735,4.155 | smd 2.95 x 7.62: I1 -3.735,-1.145; I2 3.735,-1.145
PQFN88 = smd 1.25 x 1.33: D1 -3,4.055; D2 -1,4.055; D3 1,4.055; D4 3,4.055 | smd 7 x 5.5: DT 0,0.82 | smd 1.25 x 1.28: G -3,-4.07; S1 -1,-4.07; S2 1,-4.07; S3 3,-4.07
MINI-SB-50 = drill 2.54: +1 -6.096,14.668; +2 0,14.668; +3 -6.096,3.747; +4 0,3.747; -1 -6.096,-3.747; -2 0,-3.747; -3 -6.096,-14.668; -4 0,-14.668
SM_RADIAL_K16_1PRIMARY = smd 7.493 x 2.489: + -6.756,0; - 6.756,0
CNT = smd 0.1 x 0.1: P$1 0.001,0; P$2 -0.001,0

### Placement (x,y rotation side)
BB1  148.71,111.61 0 top
BB2  122.39,111.61 0 top
C1  102.74,183.19 0 top  (outside the outline)
C10  76.34,80.91 0 top
C11  80.49,79.01 0 top
C12  80.44,76.51 0 top
C13  97.48,65.23 90 top
C14  101.51,66.82 315 top
C15  87.5,183.19 0 top  (outside the outline)
C16  108.33,63.06 90 top
C17  103.04,64.84 44.6 top
C18  99.64,63.91 270 top
C19  103.48,56.11 0 top
C20  98.62,53.93 90 top
C21  110.6,62.83 90 top
C22  112.66,65.89 135.1 top
C23  92.58,183.19 0 top  (outside the outline)
C24  81.15,178.11 0 top  (outside the outline)
C25  134.49,178.11 0 top  (outside the outline)
C26  33.86,130.74 0 top  (outside the outline)
C27  129.41,178.11 0 top  (outside the outline)
C28  107.82,183.19 0 top  (outside the outline)
C29  96.09,152.33 0 top  (outside the outline)
C30  102.44,152.33 0 top  (outside the outline)
C31  116.39,67.83 135 top
C32  114.51,70.91 315 top
C33  58.29,178.11 0 top  (outside the outline)
C34  126.87,183.19 0 top  (outside the outline)
C35  120.52,183.19 0 top  (outside the outline)
C36  114.17,183.19 0 top  (outside the outline)
C37  68.45,183.19 0 top  (outside the outline)
C38  64.64,183.19 0 top  (outside the outline)
D1  151.66,43.94 0 top
D2  141.54,79.24 0 top
D3  138.68,91.83 0 top
D4  93.79,65.37 90 top
F1  156.52,31.95 0 top
IC1  107.29,70.41 135 top
J3  51.55,108.44 0 top
J4  79.52,108.28 0 top
L1  87.5,167.95 0 top  (outside the outline)
L2  102.74,173.03 0 top  (outside the outline)
L3  92.75,58.36 180 top
LDO  81.97,84.05 90 top
LED1  101.98,194.43 0 top  (outside the outline)
R1  67.18,173.03 0 top  (outside the outline)
R2  72.26,173.03 0 top  (outside the outline)
R3  63.37,173.03 0 top  (outside the outline)
R4  59.56,173.03 0 top  (outside the outline)
R5  55.75,173.03 0 top  (outside the outline)
R10  76.38,79.13 0 top
R11  76.44,76.83 0 top
R12  76.5,74.53 0 top
R13  102.31,61.55 0 top
R14  99.64,60.73 270 top
R17  99.36,51.03 0 top
R18  128.14,173.03 0 top  (outside the outline)
R19  65.91,167.95 0 top  (outside the outline)
R20  82.42,173.03 0 top  (outside the outline)
R24  121.79,173.03 0 top  (outside the outline)
R25  59.56,167.95 0 top  (outside the outline)
R26  53.21,167.95 0 top  (outside the outline)
R27  115.44,173.03 0 top  (outside the outline)
R28  109.09,173.03 0 top  (outside the outline)
R29  46.86,167.95 0 top  (outside the outline)
R_FB1  103.42,57.85 180 top
R_FB2  106.75,57.84 180 top
S1  101.76,90.51 0 top
SV1  111.46,53.53 0 top
TP1  0,16 0 top
TP2  0,21 0 top
TP3  0,26 0 top
TP4  0,31 0 top
TP5  0,36 0 top
TP6  0,41 0 top
TP7  0,46 0 top
TP8  0,51 0 top
TP9  0,56 0 top
TP10  0,61 0 top
TP11  0,66 0 top
TP12  0,71 0 top
TP13  0,76 0 top
TP14  0,81 0 top
TP15  0,86 0 top
TP16  0,91 0 top
TP17  0,96 0 top
TP18  0,101 0 top
TP19  0,106 0 top
TP20  0,111 0 top
TP21  0,116 0 top
TP22  0,121 0 top
TP23  0,126 0 top  (outside the outline)
TP24  0,131 0 top  (outside the outline)
TP25  0,136 0 top  (outside the outline)
TP26  0,141 0 top  (outside the outline)
TP27  0,146 0 top  (outside the outline)
TP28  0,151 0 top  (outside the outline)
TP29  0,156 0 top  (outside the outline)
TP30  0,161 0 top  (outside the outline)
TP31  0,166 0 top  (outside the outline)
TP32  0,171 0 top  (outside the outline)
TP33  0,176 0 top  (outside the outline)
TP34  0,181 0 top  (outside the outline)
TP35  0,186 0 top  (outside the outline)
TP36  0,191 0 top  (outside the outline)
TP37  0,196 0 top  (outside the outline)
TP38  0,201 0 top  (outside the outline)
TP39  0,206 0 top  (outside the outline)
TVS_DIODE  103.22,80.93 0 top
U$1  159.76,72.85 0 top
U$2  57.09,64.96 270 top
U$3  123.66,55.27 90 top
U$4  130.16,67.31 90 top
U$5  115.56,91.85 180 top
U$14  137.5,40.41 180 top
U$16  157.58,17.78 270 top
U$18  124.26,22.15 270 top
U$19  99.13,22.15 270 top
U$20  135.21,51.49 180 top
U$21  141.51,61.78 0 top
U$22  141.21,72.37 0 top
U$23  128.01,84.36 180 top
U$24  127.75,96.01 180 top
U$25  131.3,45.83 0 top
U$27  136.22,66.93 0 top
U$30  121.9,86.13 0 top

### Tracks (layer width: path | path; a pad name or v marks a point on that pad's centre or on a via)
3V3  (7 unrouted)
AGND  (3 unrouted)
APHASE  (8 unrouted)
  Top 0.305: U$20.DT 136.03,49.23 132.63,45.83 U$25.P$1
  pour Top: 144.6,38.3 144.6,57.5 133.6,57.5 133.6,38.3
BPHASE  (8 unrouted)
  Top 0.305: U$21.DT 137.25,66.86 137.32,66.93 U$27.P$1
  pour Top: 149,61.8 149,71.4 139.2,71.4 139.2,61.8
BST
  Top 0.254: C18.2 99.74,62.94 102.98,62.94 104.8,64.75 104.8,66.15 IC1.45
CPH
  Top 0.305: IC1.4 110.6,65.33 C21.2
CPHASE  (7 unrouted)
  Top 0.305: U$23.S3 124.2,88.43 U$30.P$1
  pour Top: 135.6,85.6 135.6,93.4 123.8,93.4 123.8,85.6
CPL
  Top 0.305: IC1.3 109.3,65.93 109.3,64.15 109.3,62.6 110.07,61.83 C21.1
CS  (2 unrouted)
DRV_VM  (3 unrouted)
  Top 0.305: IC1.5 111.76,64.88 111.76,53.83 SV1.2
ENABLE  (3 unrouted)
FB
  Top 0.152: R_FB2.2
  Top 0.254: IC1.48 106.21,65.44 106.21,58.15 R_FB2.2 | C19.2 104.36,57.77 R_FB1.1
  Top 0.305: R_FB1.1 R_FB2.2
GHA  (2 unrouted)
  Top 0.305: U$14.G 138.79,42.77 120.13,42.77 116,46.9 116,55.18 114.44,56.75 114.44,65.51 112.38,67.57 111.19,67.57 IC1.8
GHB  (2 unrouted)
  Top 0.305: U$22.G 132.6,68.3 131.9,67.6 122,67.6 115.9,73.7 111.64,73.7 IC1.17
GHC  (2 unrouted)
  Top 0.305: U$23.G 129.61,87.03 124.26,87.03 IC1.18
GLA  (2 unrouted)
  Top 0.305: IC1.10 111.5,68.67 113.2,68.67 115.8,66.07 115.8,58.53 120.24,54.09 137.04,54.09 138.21,55.26 U$20.G
GLB  (2 unrouted)
  Top 0.305: U$21.G 136.84,59.38 136.84,65.56 136.5,65.9 121.99,65.91 115.2,72.7 112.06,72.7 IC1.15
GLC  (2 unrouted)
  Top 0.305: U$24.G 130.75,99.88 129.45,98.58 124.08,98.58 123.4,97.9 123.4,88.4 112.64,77.63 112.64,76.81 IC1.20
GND  (via drill 0.35)  (49 unrouted)
  Top 0.305: C17.1 101.79,63.6 v101.3,63.6 | IC1.41 103.89,68.07 101.34,68.07 C14.1 | IC1.1 107.4,65.57 107.4,63.1 108.31,62.19 C16.1
  pour Top (rank 2): 86.8,76.5 86.8,49.1 114.6,49.1 114.6,76.5
HALL_A  (1 unrouted)
HALL_B  (1 unrouted)
HALL_C  (1 unrouted)
INHA  (2 unrouted)
INHB  (2 unrouted)
INHC  (2 unrouted)
INLA  (2 unrouted)
INLB  (2 unrouted)
INLC  (2 unrouted)
ISENA  (3 unrouted)
ISENB  (3 unrouted)
ISENC  (3 unrouted)
MISO  (3 unrouted)
MOSI  (2 unrouted)
N$1  (1 unrouted)
N$5  (2 unrouted)
N$13  (1 unrouted)
N$14
  Top 0.152: C20.1 98.62,51.14 R17.1
N$15  (6 unrouted)
N$16  (1 unrouted)
N$17  (1 unrouted)
N$18  (1 unrouted)
N$19  (1 unrouted)
N$20  (1 unrouted)
N$21  (1 unrouted)
N$22  (3 unrouted)
  pour Top: 137.5,58 133.2,58 129.8,61.4 124.4,61.4 124.4,66.1 132.6,66.1 133.9,64.8 137.5,64.8
N$23  (1 unrouted)
N$24  (3 unrouted)
  pour Top: 120.6,47.4 120.6,53.7 129.7,53.7 129.7,47.4
N$27
  pour Top: 122.8,101.41 115.81,101.41 115.8,101.4 115.8,88.9 121.8,88.9 122.8,89.9
  pour Top: 122.8,101.4 129.8,101.4 129.8,99.5 129.3,99 129.2,98.9 122.8,98.9
NFAULT  (3 unrouted)
PGA_GND  (1 unrouted)
RCL
  Top 0.254: IC1.46 105.25,65.9 105.25,63.49 103.31,61.55 R13.2
RT/SD
  Top 0.254: IC1.47 105.71,65.64 105.71,62.08 103.51,59.88 R14.2
SCLK  (2 unrouted)
SHA  (1 unrouted)
  Top 0.305: IC1.9 111.34,68.12 112.87,68.12 115.14,65.85 115.14,56.84 116.7,55.28 116.7,49.6 120.47,45.83 U$25.P$2
SHB  (1 unrouted)
  Top 0.305: IC1.16 111.85,73.2 115.55,73.2 121.82,66.93 U$27.P$2
SHC  (1 unrouted)
  Top 0.305: 121.9,86.1 U$30.P$2 113.2,77.43 113.2,76.67 IC1.19
SNA  (via drill 0.35)  (1 unrouted)
  Top 0.305: IC1.12 111.89,69.7 114.15,69.7 v114.2,69.65 114.45,69.65 115.65,68.45 C31.2 | U$3.E2 119.5,61.6 v119.6,61.7
  Route15 0.305: v114.2,69.65 114.45,69.65 119.6,64.5 v119.6,61.7
  Bottom 0.305: 114.3,69.65 v114.2,69.65
SNB  (via drill 0.35)  (1 unrouted)
  Top 0.305: v120.9,71.6 120.94,71.6 120.94,71.59 122.91,71.59 123.45,71.05 U$4.E2 | IC1.13 112.21,70.44 114.94,70.44 115.2,70.7 115.2,71.3 115.4,71.5 v115.3,71.6 115.23,71.53 115.23,70.39 C32.2
  Route15 0.305: v120.9,71.6 120.5,72 115.7,72 v115.3,71.6
SNC  (via drill 0.35)  (2 unrouted)
  Top 0.305: U$5.E2 111.83,85.62 v111.8,85.6 | v110.2,76.7 110.23,76.67 110.23,75.82 IC1.22
  Route15 0.305: v111.8,85.6 110.2,84 v110.2,76.7
SOA  (1 unrouted)
SOB  (2 unrouted)
SOC  (2 unrouted)
SPA  (via drill 0.35)  (1 unrouted)
  Top 0.305: IC1.11 111.42,69.53 111.77,69.17 113.65,69.17 114.12,68.7 v114.2,68.7 115.69,67.21 C31.1 | U$3.E1 117.9,53.14 v117.9,53.7
  Route15 0.305: v117.9,53.7 117.9,64.65 114.63,67.93 114.63,68.27 v114.2,68.7
SPB  (via drill 0.35)  (1 unrouted)
  Top 0.305: U$4.E1 124.88,64.7 v120.9,64.7 | IC1.14 111.42,71.29 111.77,71.65 112.59,71.65 v112.59,71.62 113.8,71.62 C32.1
  Route15 0.305: v120.9,64.7 v120.89,64.71 120.89,64.92 114.19,71.62 v112.59,71.62
SPC  (via drill 0.35)  (2 unrouted)
  Top 0.305: U$5.E1 v117.3,85.7 | v111.2,76.7 111.2,76.09 IC1.21
  Route15 0.305: v117.3,85.7 111.2,79.6 v111.2,76.7
SW
  Top 0.305: IC1.42 104.14,67.62 102.33,67.62 99.64,64.93 C18.1 99.2,65.23 93.83,65.23 89.65,61.05 L3.P$2
  pour Top: 87.6,54.3 87.6,65.7 100.6,65.7 100.6,64.7 96.5,64.7 91.9,60.1 91.9,54.3
VBUCK  (4 unrouted)
  pour Top (isolate 0.254): 93.5,54 93.5,60.7 103.5,60.7 103.5,54
VCC
  Top 0.305: C17.2 103.66,65.72 IC1.44
VCP  (1 unrouted)
  Top 0.305: C22.2 111.55,66.51 IC1.7
VDRAIN  (28 unrouted)
  Top 0.305: IC1.6 112.07,65.27 C22.1 113.28,54.25 SV1.3 | IC1.43 104.35,67.11 103.22,67.11 C14.2 102.22,65.62 100.52,63.93 97.68,63.93 C13.1
VGLS
  Top 0.305: C16.2 108.53,64.14 108.53,65.99 IC1.2
VSENA  (4 unrouted)
VSENB  (4 unrouted)
VSENC  (4 unrouted)
VSENVM  (4 unrouted)